# EAGLE board controller (EAGLE 6.6.0)
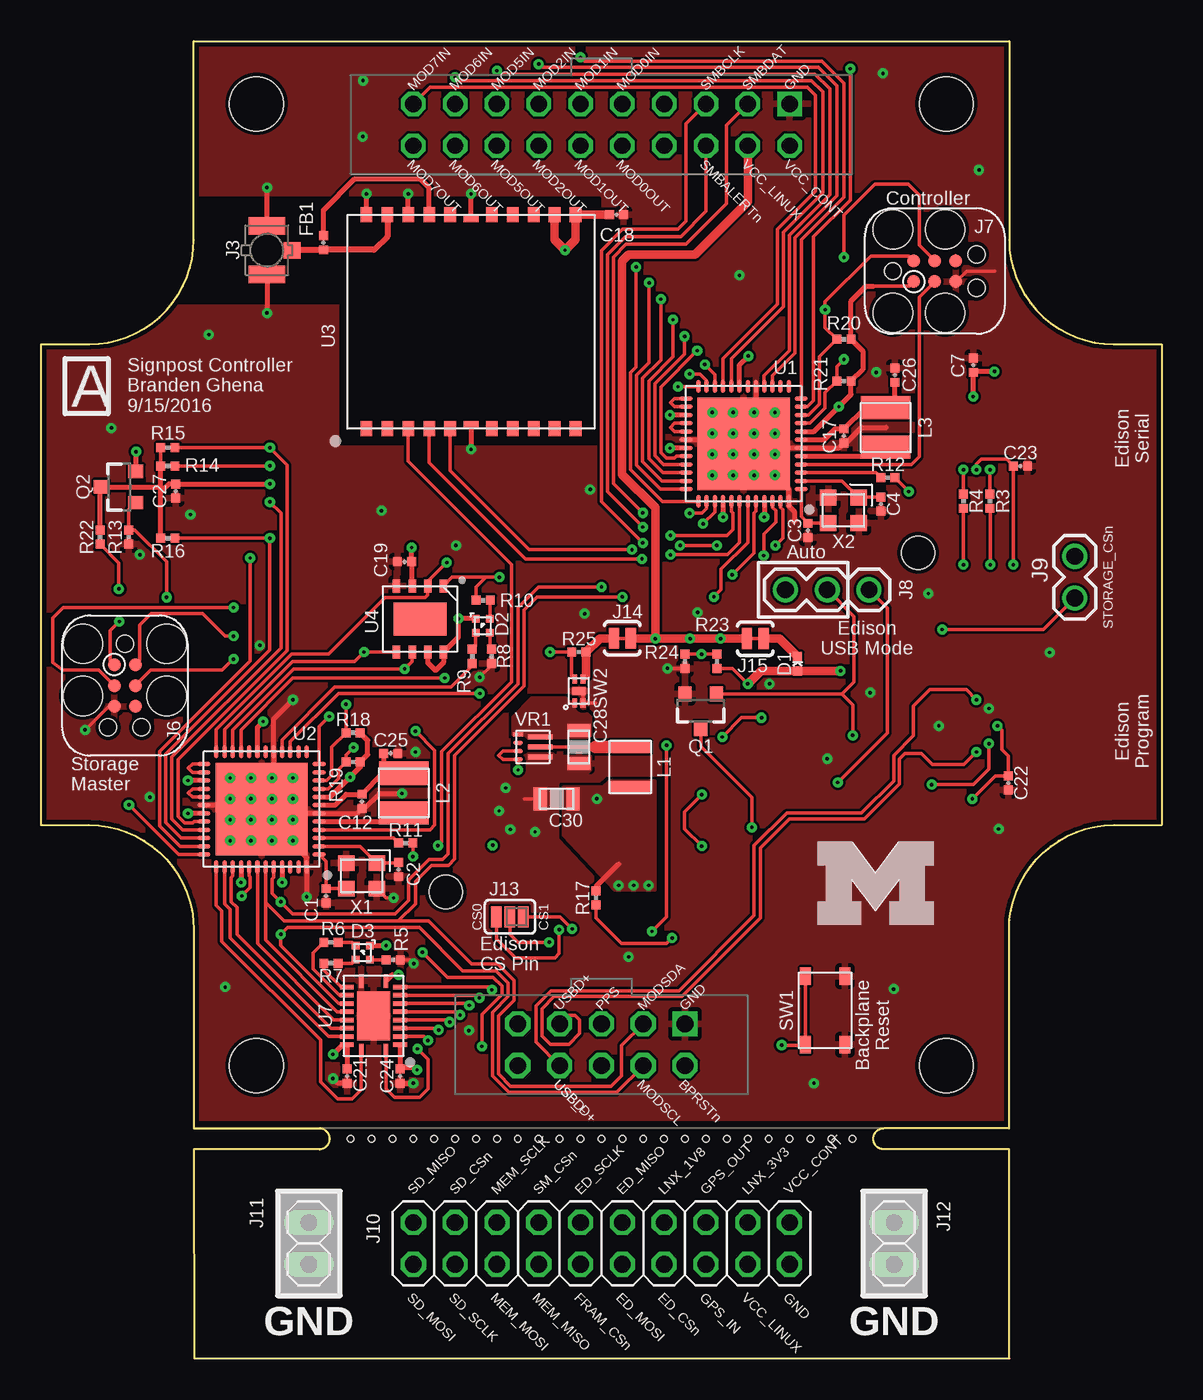
[diagram p5: board, top side]
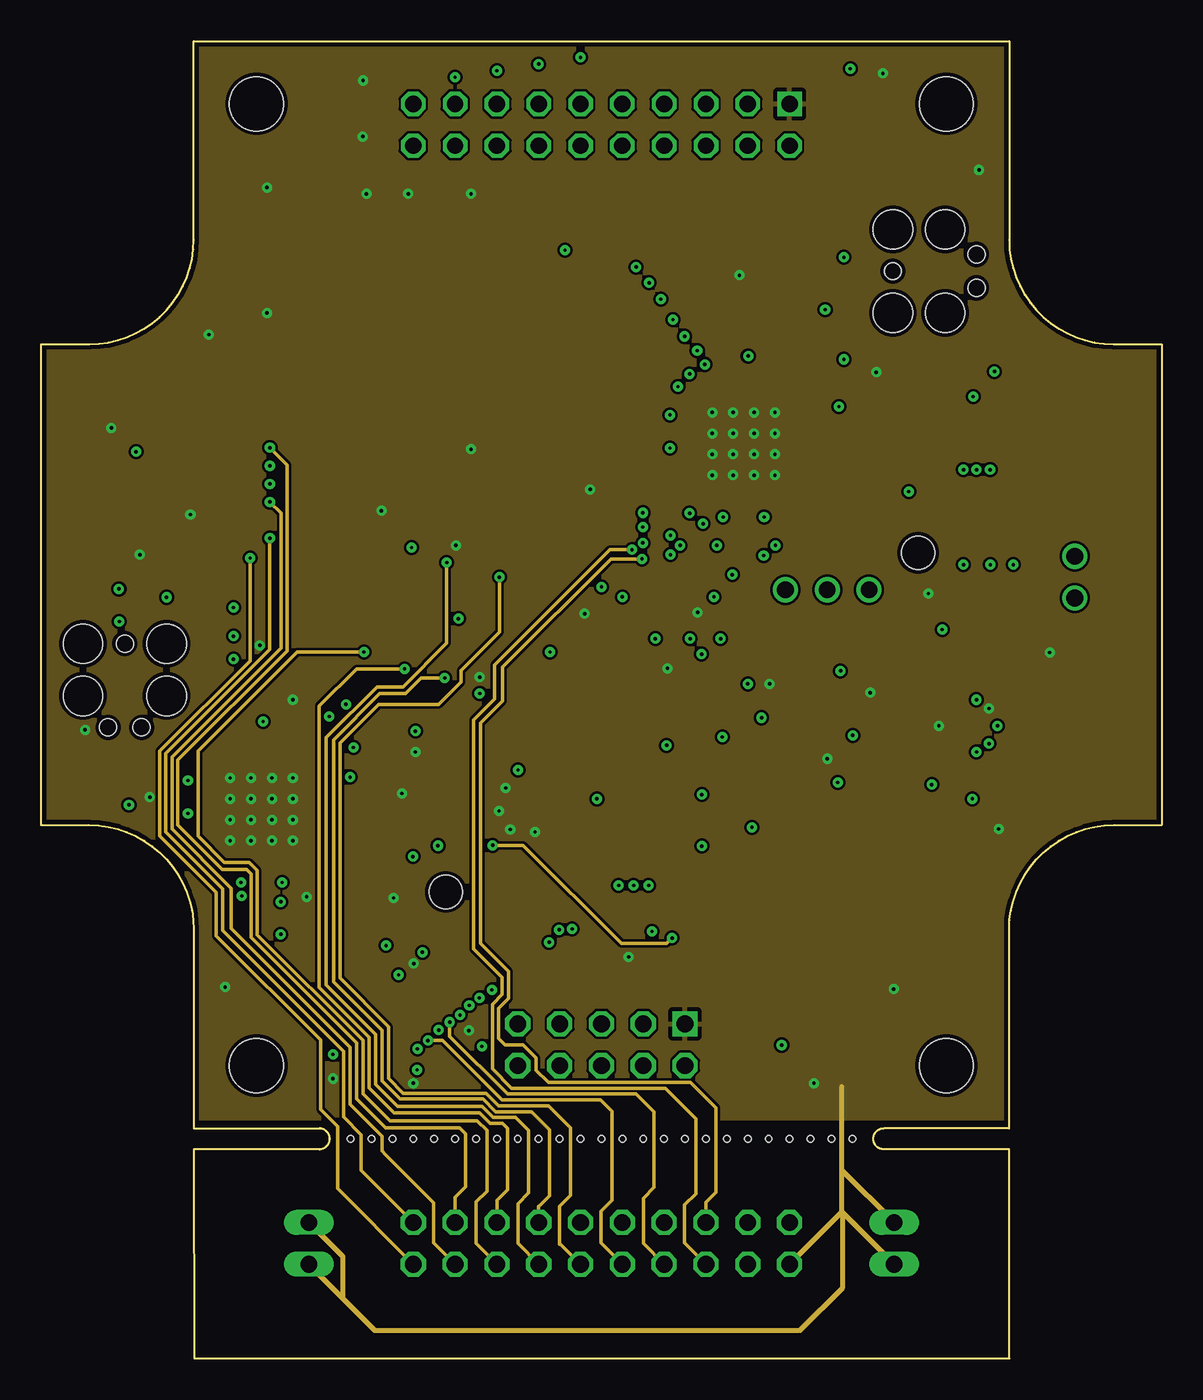
[diagram p6: board, inner layer Route2]
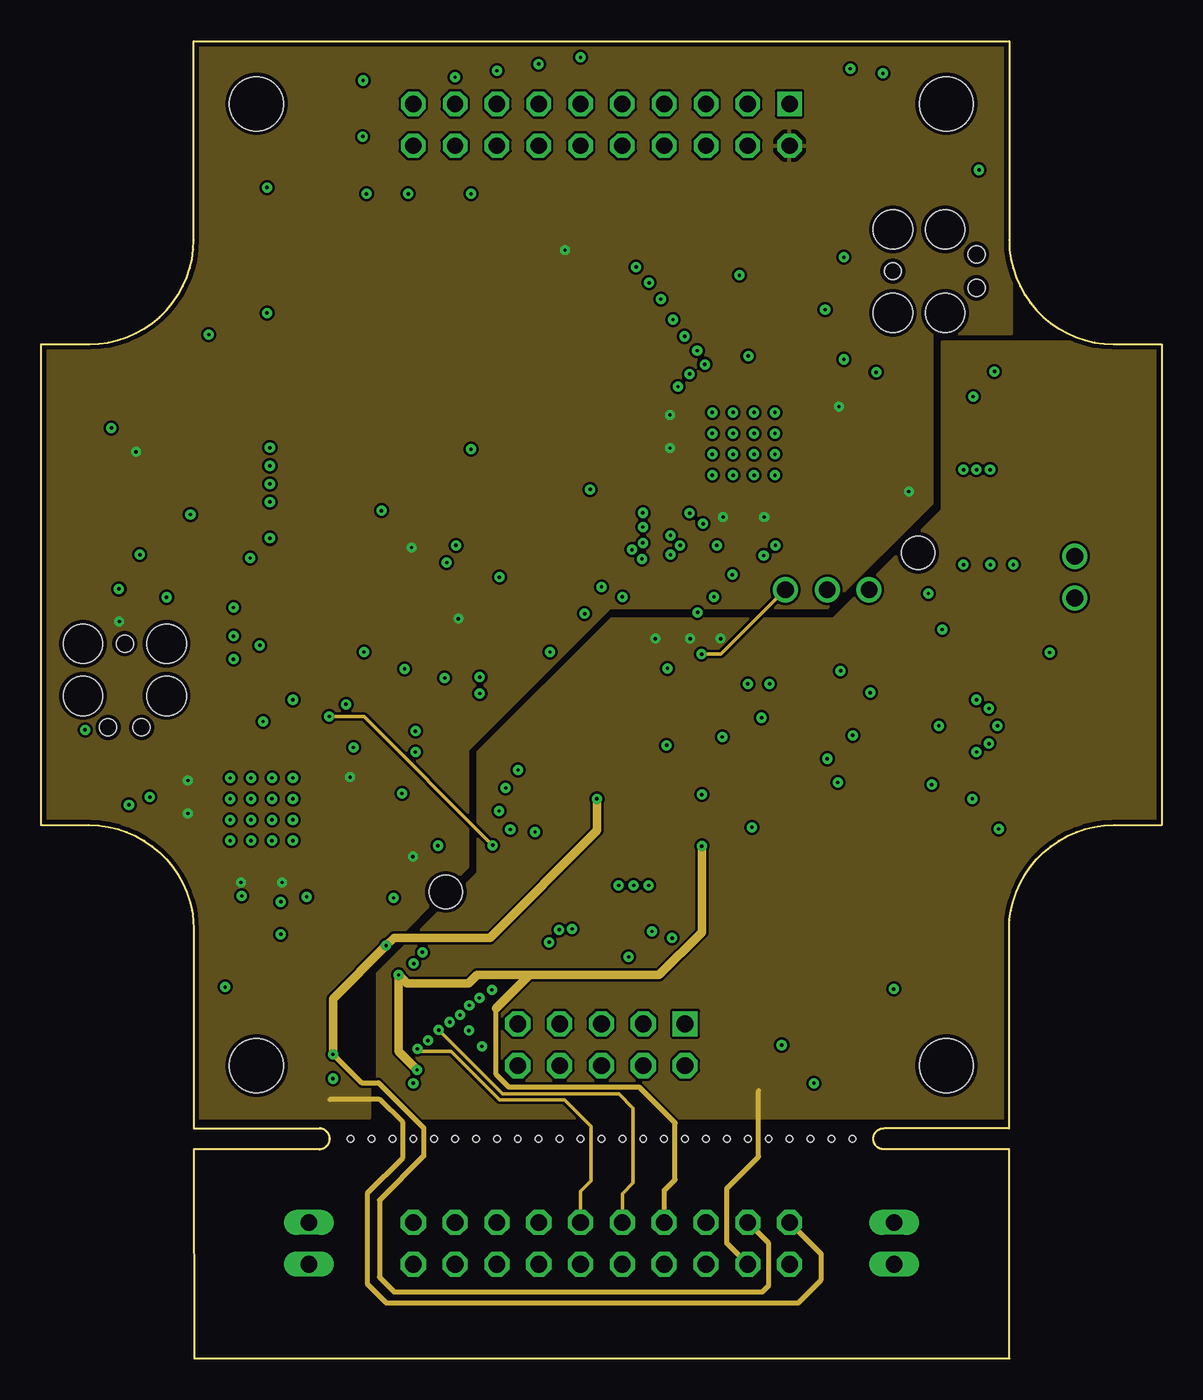
[diagram p7: board, inner layer Route15]
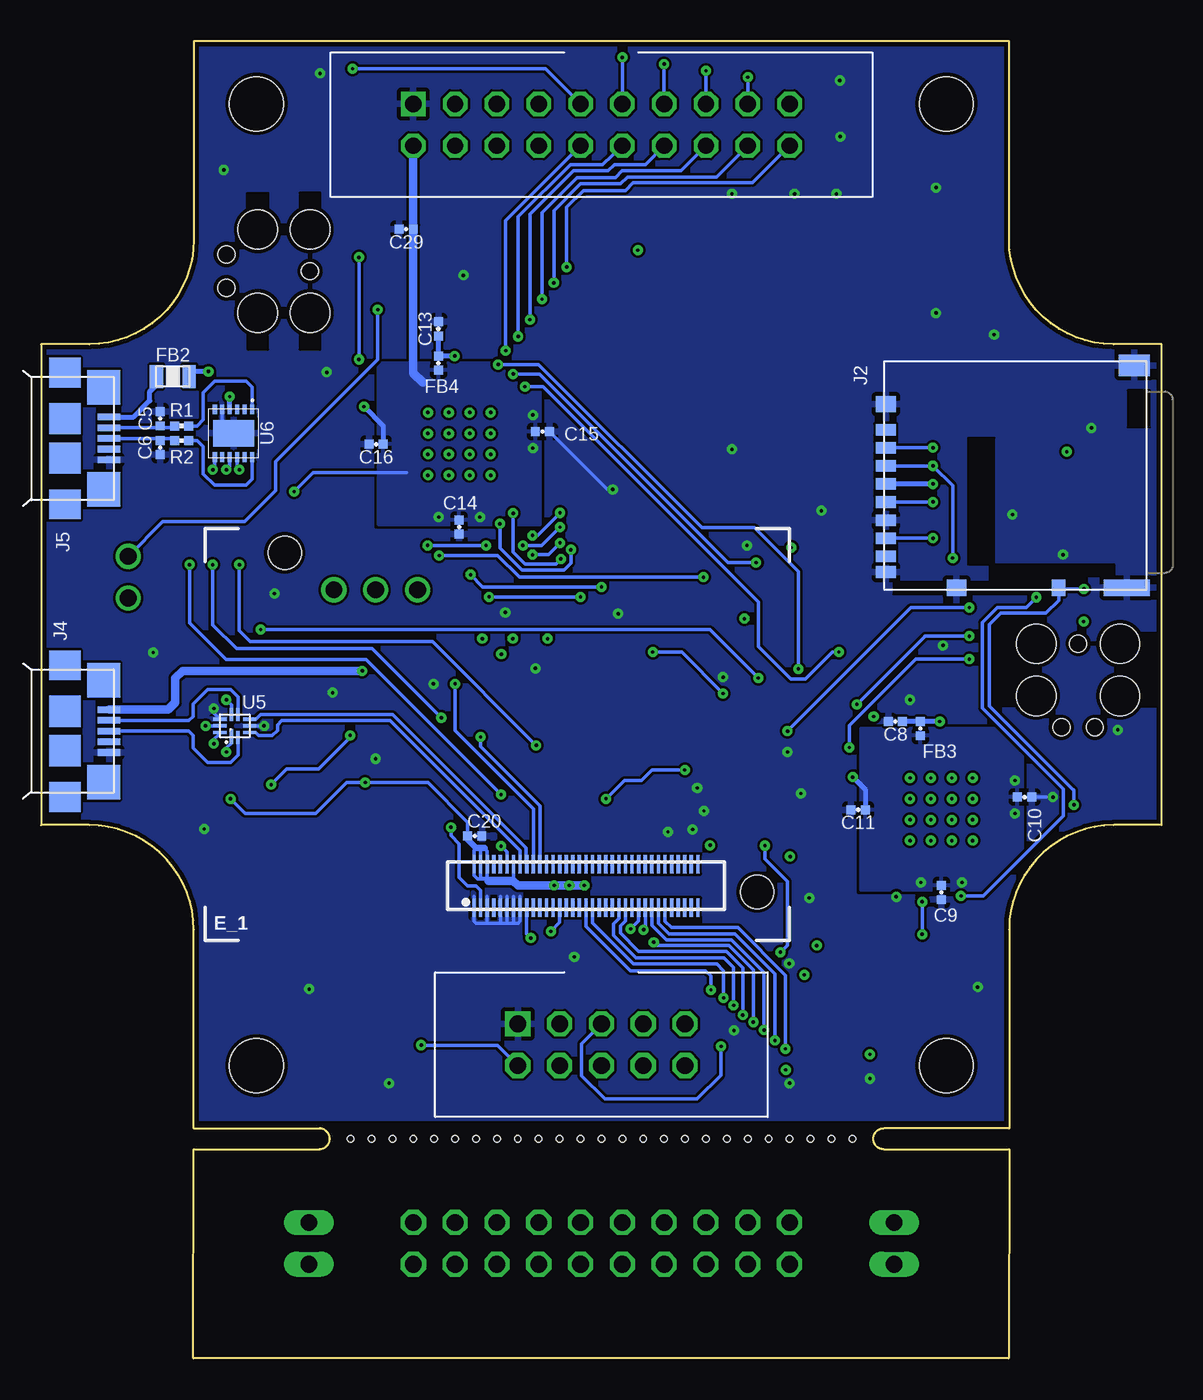
[diagram p8: board, bottom side, seen from below]

Size 68.07 x 80.01 mm. Coordinates in mm from the lower left corner, seen from the top.
Outline: 9.27,80.01 58.8,80.01 58.8,67.94 arc90 65.15,61.59 68.07,61.59 68.07,32.39 65.15,32.39 arc90 58.8,26.04 58.8,13.97 51.18,13.97 arc180 51.18,12.7 58.8,12.7 58.83,0 9.3,0 9.27,12.7 16.89,12.7 arc180 16.89,13.97 9.27,13.97 9.27,26.04 arc90 2.92,32.39 0,32.39 0,61.59 2.92,61.59 arc90 9.27,67.94 9.27,80.01
Copper layers (1+2*15+16): Top 0.0178mm / dielectric 12mil / Route2 0.0356mm / dielectric 28mil / Route15 0.0356mm / dielectric 12mil / Bottom 0.0178mm
Design rules "sunstone-4lyr_v1.0.0.3 *": minimum track width 6mil, minimum drill 8mil, track to track 6mil, track to pad 6mil, pad to pad 6mil, via to via 6mil, smd to smd 6mil, copper to edge 10mil, drill to drill 16mil, minimum pad ring 8mil, minimum via ring 8mil, stop-mask expansion 3mil, vias tented up to drill 50mil, thermal gap 10mil
Holes 0.38 mm at 34.04,13.34 35.31,13.34 32.77,13.34 37.85,13.34 39.12,13.34 36.58,13.34 30.23,13.34 31.5,13.34 28.96,13.34 45.47,13.34 46.74,13.34 44.2,13.34 49.28,13.34 48.01,13.34 41.66,13.34 42.93,13.34 40.39,13.34 22.61,13.34 23.88,13.34 21.34,13.34 26.42,13.34 27.69,13.34 25.15,13.34 18.8,13.34 20.07,13.34
Holes 3.26 mm at 13.08,76.2 54.99,76.2 54.99,17.78 13.08,17.78

## Footprints (pad centres in the part's own frame; a part is rotated, then mirrored left to right if it is on the bottom)
0402_CAP = smd 0.536 x 0.546: 1 -0.433,0; 2 0.433,0
0805_CAP = smd 0.8 x 1.4: P$1 1,0; P$2 -1,0
0402_DIODE = smd 0.536 x 0.546: ANODE -0.433,0; CATHODE 0.433,0
1MM_SQ_4PAD = smd 0.457 x 0.457: 1 0.432,0.432; 2 0.432,-0.432; 3 -0.432,-0.432; 4 -0.432,0.432
EDISON_DAUGHTER = smd 1.14 x 0.2: 1 1.98,19.17; 2 4.62,19.17; 3 1.98,18.77; 4 4.62,18.77; 5 1.98,18.37; 6 4.62,18.37; 7 1.98,17.97; 8 4.62,17.97; 9 1.98,17.57; 10 4.62,17.57; 11 1.98,17.17; 12 4.62,17.17; 13 1.98,16.77; 14 4.62,16.77; 15 1.98,16.37; 16 4.62,16.37; 17 1.98,15.97; 18 4.62,15.97; 19 1.98,15.57; 20 4.62,15.57; 21 1.98,15.17; 22 4.62,15.17; 23 1.98,14.77; 24 4.62,14.77; 25 1.98,14.37; 26 4.62,14.37; 27 1.98,13.97; 28 4.62,13.97; 29 1.98,13.57; 30 4.62,13.57; 31 1.98,13.17; 32 4.62,13.17; 33 1.98,12.77; 34 4.62,12.77; 35 1.98,12.37; 36 4.62,12.37; 37 1.98,11.97; 38 4.62,11.97; 39 1.98,11.57; 40 4.62,11.57; 41 1.98,11.17; 42 4.62,11.17; 43 1.98,10.77; 44 4.62,10.77; 45 1.98,10.37; 46 4.62,10.37; 47 1.98,9.97; 48 4.62,9.97; 49 1.98,9.57; 50 4.62,9.57; 51 1.98,9.17; 52 4.62,9.17; 53 1.98,8.77; 54 4.62,8.77; 55 1.98,8.37; 56 4.62,8.37; 57 1.98,7.97; 58 4.62,7.97; 59 1.98,7.57; 60 4.62,7.57; 61 1.98,7.17; 62 4.62,7.17; 63 1.98,6.77; 64 4.62,6.77; 65 1.98,6.37; 66 4.62,6.37; 67 1.98,5.97; 68 4.62,5.97; 69 1.98,5.57; 70 4.62,5.57 | hole 2: 23.53,30.67; 2.93,1.98
MODULE_CONTROLLER = drill 0.991 square: 1 11.43,29.21 | drill 0.991 octagon: 2 11.43,26.67; 3 8.89,29.21; 4 8.89,26.67; 5 6.35,29.21; 6 6.35,26.67; 7 3.81,29.21; 8 3.81,26.67; 9 1.27,29.21; 10 1.27,26.67; 11 -1.27,29.21; 12 -1.27,26.67; 13 -3.81,29.21; 14 -3.81,26.67; 15 -6.35,29.21; 16 -6.35,26.67; 17 -8.89,29.21; 18 -8.89,26.67; 19 -11.43,29.21; 20 -11.43,26.67 | drill 1.016 square: 21 5.08,-26.67 | drill 1.016 octagon: 22 5.08,-29.21; 23 2.54,-26.67; 24 2.54,-29.21; 25 0,-26.67; 26 0,-29.21; 27 -2.54,-26.67; 28 -2.54,-29.21; 29 -5.08,-26.67; 30 -5.08,-29.21
DM3AT-SF-PEJM5 = smd 0.7 x 1.2: 1 3.2,-0.1; 2 2.1,-0.1; 3 1,-0.1; 4 -0.1,-0.1; 5 -1.2,-0.1; 6 -2.3,-0.1; 7 -3.4,-0.1; 8 -4.5,-0.1; B -5.45,-0.1 | smd 1 x 0.8: A -6.4,-10.6 | smd 1 x 1.2: MOUNT0 4.75,-0.1; MOUNT1 -6.4,-4.4 | smd 1 x 2.8: MOUNT2 -6.4,-14.75 | smd 1.3 x 1.9: MOUNT3 7.1,-15.2
U.FL_SMT = smd 1.05 x 2.2: GND1 -1.475,0; GND2 1.475,0 | smd 1 x 1.05: SIG 0,-1.525
USB_MICRO_B-HIROSE-ZX62-B-5PA(11) = smd 0.4 x 1.35: 1 -1.3,4.125; 2 -0.65,4.125; 3 0,4.125; 4 0.65,4.125; 5 1.3,4.125 | smd 2.1 x 2: P$1 3.1,3.8; P$2 -3.1,3.8 | smd 1.8 x 1.9: P$3 -4,1.45; P$6 4,1.45 | smd 1.9 x 1.9: P$4 -1.2,1.45; P$5 1.2,1.45
TC2030-IDC = smd 0.787 x 0.787: 1 -1.27,-0.635; 2 -1.27,0.635; 3 0,-0.635; 4 0,0.635; 5 1.27,-0.635; 6 1.27,0.635 | hole 2.375: -2.54,2.54; 0.635,2.54; 0.635,-2.54; -2.54,-2.54 | hole 1.016: -2.54,0; 2.54,1.016; 2.54,-1.016
1X03 = drill 1.016: 1 -2.54,0; 2 0,0; 3 2.54,0
1X02 = drill 1.016: 1 0,0; 2 2.54,0
2X10 = drill 1.016 octagon: 1 -11.43,-1.27; 2 -11.43,1.27; 3 -8.89,-1.27; 4 -8.89,1.27; 5 -6.35,-1.27; 6 -6.35,1.27; 7 -3.81,-1.27; 8 -3.81,1.27; 9 -1.27,-1.27; 10 -1.27,1.27; 11 1.27,-1.27; 12 1.27,1.27; 13 3.81,-1.27; 14 3.81,1.27; 15 6.35,-1.27; 16 6.35,1.27; 17 8.89,-1.27; 18 8.89,1.27; 19 11.43,-1.27; 20 11.43,1.27
1X02' = drill 1.016 long: 1 -1.27,0; 2 1.27,0
SJ_3_PASTE2&3 = smd 0.635 x 1.27: 1 -0.813,0; 2 0,0; 3 0.813,0
SJ_2S-TRACE = smd 0.635 x 1.27: 1 -0.508,0; 2 0.508,0
DFE322512C = smd 0.75 x 2.5: P$1 1.225,0; P$2 -1.225,0
1212 = smd 1.4 x 3: P$1 -1.2,0; P$2 1.2,0
SOT23-3 = smd 0.8 x 0.9: 1 -0.95,-1; 2 0.95,-1; 3 0,1.1
0402_RES = smd 0.536 x 0.546: 1 -0.433,0; 2 0.433,0
PTS810SJ = smd 1.05 x 0.65: 1 -2.075,1.2; 2 2.075,1.2; 3 2.075,-1.2; 4 -2.075,-1.2
TDFN4 = smd 0.3 x 0.55: 1 -0.25,-0.725; 2 0.25,-0.725; 3 0.25,0.725; 4 -0.25,0.725 | smd 0.86 x 0.5: PAD 0,0
QFN-48-7MM = smd 0.8 x 0.28: 1 -3.5,2.75; 2 -3.5,2.25; 3 -3.5,1.75; 4 -3.5,1.25; 5 -3.5,0.75; 6 -3.5,0.25; 7 -3.5,-0.25; 8 -3.5,-0.75; 9 -3.5,-1.25; 10 -3.5,-1.75; 11 -3.5,-2.25; 12 -3.5,-2.75; 25 3.5,-2.75; 26 3.5,-2.25; 27 3.5,-1.75; 28 3.5,-1.25; 29 3.5,-0.75; 30 3.5,-0.25; 31 3.5,0.25; 32 3.5,0.75; 33 3.5,1.25; 34 3.5,1.75; 35 3.5,2.25; 36 3.5,2.75 | smd 0.28 x 0.8: 13 -2.75,-3.5; 14 -2.25,-3.5; 15 -1.75,-3.5; 16 -1.25,-3.5; 17 -0.75,-3.5; 18 -0.25,-3.5; 19 0.25,-3.5; 20 0.75,-3.5; 21 1.25,-3.5; 22 1.75,-3.5; 23 2.25,-3.5; 24 2.75,-3.5; 37 2.75,3.5; 38 2.25,3.5; 39 1.75,3.5; 40 1.25,3.5; 41 0.75,3.5; 42 0.25,3.5; 43 -0.25,3.5; 44 -0.75,3.5; 45 -1.25,3.5; 46 -1.75,3.5; 47 -2.25,3.5; 48 -2.75,3.5 | smd 5.6 x 5.6: THERMAL 0,0
RXM-GPS-RM-T = smd 0.711 x 0.914: 1 -6.35,-6.502; 2 -5.08,-6.502; 3 -3.81,-6.502; 4 -2.54,-6.502; 5 -1.27,-6.502; 6 1.27,-6.502; 7 2.54,-6.502; 8 3.81,-6.502; 9 5.08,-6.502; 10 6.35,-6.502; 11 6.35,6.502; 12 5.08,6.502; 13 3.81,6.502; 14 2.54,6.502; 15 1.27,6.502; 16 -1.27,6.502; 17 -2.54,6.502; 18 -3.81,6.502; 19 -5.08,6.502; 20 -6.35,6.502 | smd 0.914 x 0.457: 21 0,-6.274; 22 0,6.274
TDFN-8 = smd 0.45 x 0.8: 1 -1.425,-2.007; 2 -0.475,-2.007; 3 0.475,-2.007; 4 1.425,-2.007; 5 1.425,2.007; 6 0.475,2.007; 7 -0.475,2.007; 8 -1.425,2.007 | smd 3.2 x 2: NC 0,0
UQFN-10 = smd 0.2 x 0.9: 1 -0.2,-0.65 | smd 0.2 x 0.8: 2 0.2,-0.7; 6 0.2,0.7; 7 -0.2,0.7 | smd 0.8 x 0.2: 3 0.9,-0.4; 4 0.9,0; 5 0.9,0.4; 8 -0.9,0.4; 9 -0.9,0; 10 -0.9,-0.4
DFN-12/3MM = smd 0.6 x 0.25: 1 -1.45,1.13; 2 -1.45,0.68; 3 -1.45,0.23; 4 -1.45,-0.23; 5 -1.45,-0.68; 6 -1.45,-1.13; 7 1.45,-1.13; 8 1.45,-0.68; 9 1.45,-0.23; 10 1.45,0.23; 11 1.45,0.68; 12 1.45,1.13 | smd 1.6 x 2.5: 13 0,0
R-PVQFN-N20 = smd 0.825 x 0.28: 1 -2.112,-0.75; 10 2.112,-0.75; 11 2.112,0.75; 20 -2.112,0.75 | smd 0.28 x 0.825: 2 -1.75,-1.613; 3 -1.25,-1.613; 4 -0.75,-1.613; 5 -0.25,-1.613; 6 0.25,-1.613; 7 0.75,-1.613; 8 1.25,-1.613; 9 1.75,-1.613; 12 1.75,1.613; 13 1.25,1.613; 14 0.75,1.613; 15 0.25,1.613; 16 -0.25,1.613; 17 -0.75,1.613; 18 -1.25,1.613; 19 -1.75,1.613 | smd 3 x 2: THERMAL 0,0
RLT0007A = smd 0.6 x 0.25: 1 -0.9,0.75; 2 -0.9,0.25; 3 -0.9,-0.25; 4 -0.9,-0.75 | smd 1.5 x 0.3: 5 0.45,-0.6; 6 0.45,0; 7 0.45,0.6
FHXXX = smd 1 x 0.95: 1 -0.925,-0.775; 2 0.925,-0.775; 3 0.925,0.775; 4 -0.925,0.775

## Placement (x,y rotation side)
C1  8pF  [0402_CAP]  17.3,28.09 270 top
C2  8pF  [0402_CAP]  21.72,29.69 270 top
C3  8pF  [0402_CAP]  46.58,50.29 270 top
C4  8pF  [0402_CAP]  51,51.89 270 top
C5  47pF  [0402_CAP]  60.83,57.07 90 bottom
C6  47pF  [0402_CAP]  60.83,55.32 270 bottom
C7  10nF  [0402_CAP]  56.62,60.33 90 top
C8  100nF  [0402_CAP]  16.18,38.68 180 bottom
C9  100nF  [0402_CAP]  13.39,28.3 270 bottom
C10  100nF  [0402_CAP]  8.33,34.09 0 bottom
C11  100nF  [0402_CAP]  18.44,33.32 180 bottom
C12  100nF  [0402_CAP]  19.48,33.83 270 top
C13  100nF  [0402_CAP]  43.94,62.53 90 bottom
C14  100nF  [0402_CAP]  42.67,50.5 270 bottom
C15  100nF  [0402_CAP]  37.62,56.29 0 bottom
C16  100nF  [0402_CAP]  47.73,55.52 180 bottom
C17  100nF  [0402_CAP]  48.77,56.03 270 top
C18  100nF  [0402_CAP]  34.95,69.47 0 top
C19  100nF  [0402_CAP]  22.07,48.39 180 top
C20  100nF  [0402_CAP]  41.73,31.72 0 bottom
C21  100nF  [0402_CAP]  18.58,17.15 90 top
C22  100nF  [0402_CAP]  58.75,34.95 270 top
C23  100nF  [0402_CAP]  59.49,54.2 0 top
C24  100nF  [0402_CAP]  21.81,17.15 90 top
C25  4.7uF  [0402_CAP]  21.23,36.75 0 top
C26  4.7uF  [0402_CAP]  51.87,59.72 90 top
C27  4.7uF  [0402_CAP]  8.18,52.68 270 top
C28  10uF  [0805_CAP]  32.66,37.13 90 top
C29  10uF  [0402_CAP]  45.9,68.58 180 bottom
C30  22uF  [0805_CAP]  31.32,33.99 0 top
D1  DIODE  [0402_DIODE]  45.95,42.19 90 top
D2  SML-LX0404SIUPGUSB  [1MM_SQ_4PAD]  26.82,44.5 90 top
D3  SML-LX0404SIUPGUSB  [1MM_SQ_4PAD]  19.53,24.64 0 top
E_1  EDISON_CONNECTOR_SEGMENTED  [EDISON_DAUGHTER]  22.61,25.4 90 bottom
FB1  300Ω  [0402_CAP]  17.15,67.77 270 top
FB2  600Ω  [0805_CAP]  60.07,59.64 0 bottom
FB3  1.5kΩ  [0402_CAP]  14.66,38.25 270 bottom
FB4  1.5kΩ  [0402_CAP]  43.94,60.45 270 bottom
J1  MODULE_CONTROLLER  [MODULE_CONTROLLER]  34.04,46.99 0 top
J2  DM3AT-SF-PEJM5  [DM3AT-SF-PEJM5]  16.87,53.21 90 bottom
J3  U.FL-R-SMT  [U.FL_SMT]  13.72,67.31 90 top
J4  MICRO_USB_B_HIROSE_ZX62-B-5PA(11)  [USB_MICRO_B-HIROSE-ZX62-B-5PA(11)]  68.07,38.1 270 bottom
J5  MICRO_USB_B_HIROSE_ZX62-B-5PA(11)  [USB_MICRO_B-HIROSE-ZX62-B-5PA(11)]  68.07,55.88 270 bottom
J6  TC2030-JLINK-L  [TC2030-IDC]  5.08,40.87 270 top
J7  TC2030-JLINK-L  [TC2030-IDC]  54.28,66.04 0 top
J8  JUMPER-3PTH  [1X03]  47.75,46.69 0 top
J9  [1X02]  62.79,48.72 270 top
J10  [2X10]  34.04,6.98 0 top
J11  [1X02']  16.26,6.98 90 top
J12  [1X02']  51.82,6.98 90 top
J13  [SJ_3_PASTE2&3]  28.47,26.82 0 top
J14  SOLDERJUMPERTRACE  [SJ_2S-TRACE]  35.31,43.74 180 top
J15  SOLDERJUMPERTRACE  [SJ_2S-TRACE]  43.38,43.71 0 top
L1  0.47uH  [DFE322512C]  35.79,35.92 90 top
L2  22uH  [1212]  22.02,34.34 270 top
L3  22uH  [1212]  51.31,56.54 270 top
LOGO1  UMICH_SOLID_MEDIUM  [UMICH_SOLID_200MIL]  47.14,26.31 0 top
Q1  MOSFET-NCHANNELSMD  [SOT23-3]  40.07,39.34 180 top
Q2  NX3008PBK  [SOT23-3]  4.75,52.93 90 top
R1  27Ω  [0402_RES]  59.54,56.64 0 bottom
R2  27Ω  [0402_RES]  59.54,55.75 0 bottom
R3  100Ω  [0402_RES]  57.64,52.07 270 top
R4  100Ω  [0402_RES]  56.03,52.07 270 top
R5  1kΩ  [0402_RES]  21.39,24.21 0 top
R6  1kΩ  [0402_RES]  17.6,25.27 180 top
R7  1kΩ  [0402_RES]  17.6,24 180 top
R8  1kΩ  [0402_RES]  27.36,42.65 270 top
R9  1kΩ  [0402_RES]  26.19,42.65 270 top
R10  1kΩ  [0402_RES]  26.85,46.05 180 top
R11  10kΩ  [0402_RES]  22.15,31.29 0 top
R12  10kΩ  [0402_RES]  51.44,53.49 0 top
R13  10kΩ  [0402_RES]  5.31,49.89 90 top
R14  10kΩ  [0402_RES]  7.7,54.21 180 top
R15  10kΩ  [0402_RES]  7.7,55.31 180 top
R16  10kΩ  [0402_RES]  7.7,49.81 180 top
R17  10kΩ  [0402_RES]  33.71,27.97 90 top
R18  100kΩ  [0402_RES]  18.95,38 0 top
R19  100kΩ  [0402_RES]  18.95,36.22 0 top
R20  100kΩ  [0402_RES]  48.77,61.9 0 top
R21  100kΩ  [0402_RES]  48.77,59.36 0 top
R22  100kΩ  [0402_RES]  3.57,49.89 90 top
R23  332kΩ  [0402_RES]  41.05,42.34 270 top
R24  665kΩ  [0402_RES]  39.12,42.34 90 top
R25  1MΩ  [0402_RES]  32.66,42.9 0 top
SW1  PTS810SJ  [PTS810SJ]  47.62,21.13 90 top
SW2  SIP3240X  [TDFN4]  32.66,40.54 0 top
U1  SAM4LC8AA  [QFN-48-7MM]  42.67,55.55 180 top
U2  SAM4LC8AA  [QFN-48-7MM]  13.39,33.35 180 top
U3  RXM-GPS-RM-T  [RXM-GPS-RM-T]  26.11,62.97 0 top
U4  FM25CLXXB-DG  [TDFN-8]  23.01,44.91 180 top
U5  TS3USB30E  [UQFN-10]  56.31,38.42 0 bottom
U6  FTDI234XD  [DFN-12/3MM]  56.39,56.2 270 bottom
U7  TXS0108EVQFN20  [R-PVQFN-N20]  20.19,20.8 90 top
VR1  TPS62086  [RLT0007A]  29.87,37.13 0 top
X1  16MHz  [FHXXX]  19.46,29.31 180 top
X2  16MHz  [FHXXX]  48.74,51.51 180 top

## Tracks (layer width: path | path; a pad name or v marks a point on that pad's centre or on a via)
!BACKPLANE_RESET  (via drill 0.2)
  Top 0.203: v44.98,19.03 46.42,19.03 SW1.1 SW1.2
  Bottom 0.203: J1.22 40.36,19.03 v44.98,19.03
!CONTROLLER_RESET
  Top 0.203: U1.4 52.87,54.3 53.34,54.77 53.34,64.47 J7.3
!EDISON_PWRBTN  (via drill 0.2)
  Top 0.203: v38.33,25.53 38,25.2 35.26,25.2 33.71,26.75 R17.1 | 17.53,38.99 17.5,38.96 v17.5,38.99 16.89,38.37 U2.12
  Route2 0.203: v38.33,25.53 38,25.2 35.26,25.2 29.29,31.17 v27.43,31.17
  Route15 0.203: v27.43,31.17 19.61,38.99 v17.5,38.99
  Bottom 0.203: E_1.17 38.58,25.77 v38.33,25.53
!EDISON_SPI_CS
  Top 0.203: U2.42 13.14,25.19 17.78,20.55 U7.16
!EDISON_SPI_CS_1V8  (via drill 0.2)
  Top 0.203: U7.5 24.69,20.55 v24.82,20.42 | v30.86,25.27 28.96,25.27 28.47,25.76 J13.2
  Route2 0.203: v24.82,20.42 24.82,19.56 28.32,16.05 36.14,16.05 37.24,14.96 37.24,10.39 36.58,9.73 36.58,6.98 J10.13
  Bottom 0.203: v24.82,20.42 24.82,23.6 26.29,25.07 30.66,25.07 v30.86,25.27
!FRAM_CS/CONTROLLER_LED  (via drill 0.2)
  Top 0.203: v43.89,48.77 43.89,50.06 44.63,50.8 44.63,51.49 44.42,51.69 U1.46 | U4.1 24.97,47.45 v27.84,47.45 27.03,47.45 26.42,46.84 R10.2
  Route2 0.203: v27.84,47.45 27.84,44.12 25.5,41.78 25.5,41.07 24.16,39.73 20.5,39.73 18.16,37.38 18.16,23.09 21.11,20.14 21.11,16.99 22,16.1 27.03,16.1 27.79,15.34 30.81,15.34 32.16,14 32.16,9.91 31.5,9.25 31.5,6.93 31.55,6.93 J10.9
  Bottom 0.203: v43.89,48.77 40.34,48.77 39.01,47.45 v27.84,47.45
!SD_CS  (via drill 0.2)
  Top 0.203: v13.89,55.31 R15.1 | U2.32 9.31,32.6 9.22,32.51 8.71,32.51 8.31,32.9 8.31,36.37 14.94,43 14.94,54.27 v13.89,55.31 | 13.98,55.31 v13.89,55.31
  Route2 0.203: v13.89,55.31 14.94,54.27 14.94,42.98 8.31,36.35 8.31,32.39 11,29.69 12.47,29.69 12.75,29.41 12.75,25.58 19.18,19.15 19.18,15.75 20.93,14 25.43,14 25.78,13.64 25.78,10.41 25.15,9.78 J10.4
  Bottom 0.203: J2.2 v13.89,55.31
!SMBALERT  (via drill 0.2)
  Top 0.203: U1.47 44.92,51.69 45.06,51.55 45.06,49.84 v44.6,49.38 | J1.6 40.39,69.67 38.86,68.15 35.49,68.15 34.4,67.06 34.4,52.65 v36.55,50.5 | v38.81,49.38 v41.05,49.38
  Bottom 0.203: v36.55,50.5 37.67,49.38 v38.81,49.38 | v44.6,49.38 v41.05,49.38
!STORAGE_CS  (via drill 0.2)
  Top 0.203: U2.21 12.14,38.17 15.29,41.33 v24.51,41.33 | J9.2 60.88,44.27 v54.74,44.27
  Route2 0.203: v24.51,41.33 23.09,41.33 22.15,40.39 20.57,40.39 17.75,37.56 17.75,22.86 20.7,19.91 20.7,16.84 21.79,15.75 26.85,15.75 27.61,14.99 29.79,14.99 30.89,13.89 30.89,9.88 30.25,9.25 30.23,9.25 J10.8
  Bottom 0.203: v24.51,41.33 27.46,44.27 v54.74,44.27
!STORAGE_LED
  Top 0.203: U2.16 14.64,37.57 17.83,40.77 24.89,40.77 26.19,42.06 R9.2
!STORAGE_RESET  (via drill 0.2)
  Top 0.203: J6.3 3.51,41.81 1.32,41.81 0.71,42.27 0.71,44.98 1.34,45.6 v11.68,45.6 | U2.4 23.62,32.1 23.9,32.39 23.9,36.93 v22.73,38.1
  Bottom 0.203: v11.68,45.6 15.23,45.6 v22.73,38.1
CONTROLLER_BUCK/LDO_N
  Top 0.203: U1.3 50.7,53.8 R12.1
CONTROLLER_SWDCLK  (via drill 0.2)
  Top 0.203: U1.9 46.69,56.8 47.62,57.73 47.62,58.65 R21.1 48.34,60.25 v48.77,60.68 | J7.4 53.34,67.62 53.34,70.66 52.68,71.32 50.65,71.32 48.77,69.44 v48.77,66.88
  Bottom 0.203: v48.77,60.68 v48.77,66.88
CONTROLLER_SWDIO  (via drill 0.2)
  Top 0.203: U1.10 46.61,57.3 47.27,57.96 47.27,60.83 R20.1 47.62,62.61 v47.62,63.7 47.62,64.19 50.39,66.95 52.7,66.95 J7.2
  Bottom 0.203: v47.62,63.7 47.62,60.68 53.82,54.48 53.82,52.7 55.7,50.83 60.68,50.83 J9.1
CONTROLLER_XIN
  Top 0.203: U1.1 46.17,51.14 C3.1 47.81,50.73 X2.3
CONTROLLER_XOUT
  Top 0.203: C4.1 49.71,52.33 X2.1 48.65,53.3 U1.2
D+
  Bottom 0.203: J5.3 60.86,55.88 | 60.86,55.88 60.02,55.88 | 60.02,55.88 59.84,55.88 | C6.1 60.83,55.86 60.86,55.88 | R2.1 59.97,55.83 60.02,55.88
D-
  Bottom 0.203: J5.2 60.78,56.53 | 60.78,56.53 59.86,56.53 | C5.1 60.83,56.58 60.78,56.53 | 59.85,56.53 59.86,56.53 | 59.86,56.53 R1.1
EDISON_SPI_MISO
  Top 0.203: U2.39 11.64,29.29 11.56,29.21 11.56,27.74 11.91,27.38 11.91,25.76 17.62,20.05 U7.17
EDISON_SPI_MISO_1V8  (via drill 0.2)
  Top 0.203: U7.4 24.04,20.05 v24.16,19.94
  Route15 0.203: v24.16,19.94 28.04,16.05 35.1,16.05 35.97,15.19 35.97,10.67 35.31,10.01 J10.12
  Bottom 0.203: v24.16,19.94 24.16,23.44 26.14,25.43 30.1,25.43 30.98,26.3 E_1.55
EDISON_SPI_MOSI
  Top 0.203: U2.38 11.14,27.6 11.48,27.25 11.48,25.53 17.46,19.55 U7.18
EDISON_SPI_MOSI_1V8  (via drill 0.2)
  Top 0.203: U7.3 23.25,19.55 v23.5,19.3
  Route2 0.203: J10.11 34.01,7.01 34.01,8.94 34.67,9.6 34.67,15.01 33.98,15.7 27.99,15.7 24.38,19.3 v23.5,19.3
  Bottom 0.203: E_1.57 30.58,26.41 29.95,25.78 25.93,25.78 23.5,23.34 v23.5,19.3
EDISON_SPI_SCLK
  Top 0.203: U2.37 10.64,27.52 10.97,27.18 10.97,25.32 16.97,19.33 16.97,16.79 18.01,15.75 18.9,15.75 19.44,16.29 U7.20
EDISON_SPI_SCLK_1V8  (via drill 0.2)
  Top 0.203: U7.1 20.94,16.37 21.46,15.85 22.99,15.85 23.51,16.37 23.51,18.15 v22.86,18.8
  Route15 0.203: v22.86,18.8 23.01,18.64 24.89,18.64 27.84,15.7 31.8,15.7 33.4,14.1 33.4,10.8 32.77,10.16 J10.10
  Bottom 0.203: E_1.59 30.18,26.54 29.79,26.16 25.76,26.16 22.86,23.27 v22.86,18.8
EDISON_UART_RX  (via drill 0.2)
  Top 0.203: v41.38,37.74 42.55,38.91 v43.76,38.91 | v57.66,48.21 57.66,51.62 R3.2
  Bottom 0.203: E_1.22 37.78,33.56 41.38,37.16 v41.38,37.74 | v43.76,38.91 47.95,43.1 56.21,43.1 57.66,44.55 v57.66,48.21
EDISON_UART_TX  (via drill 0.2)
  Top 0.203: v37.11,25.93 38,26.82 v38,37.24 | v56.03,48.21 R4.2
  Bottom 0.203: E_1.27 36.58,26.47 v37.11,25.93 | v38,37.24 44.3,43.54 55.37,43.54 56.03,44.2 v56.03,48.21
GND  (via drill 0.2)
  Top 0.203: SW2.PAD 32.91,40.29 SW2.2 33.68,39.81 | C30.P$2 29.36,33.98 | J7.5 56.24,66.04 57.94,66.04 | R8.2 27.36,42.09 v26.65,41.38 | X1.4 20.95,27.97 v21.41,27.97 | R5.2 22.4,24.21 v22.63,23.98 | U1.THERMAL 42.67,55.52 | R24.1 v38.05,41.91 | J6.5 4.09,39.6 v2.67,38.18
  Top 0.305: U1.THERMAL 42.92,55.3 U1.6 48.47,55.3 C17.2 48.89,55.6 49.84,56.54 51.33,56.54 | U1.17 43.42,56.3 U1.THERMAL | U1.30 42.42,55.8 U1.THERMAL | 42.67,55.52 45.42,52.77 U1.48 45.42,51.77 45.75,51.44 45.75,50.8 | U2.THERMAL 13.64,33.1 U2.6 19.18,33.1 C12.2 19.63,33.4 20.55,34.31 v21.92,34.31 | U2.THERMAL 13.39,33.17 16.14,30.42 U2.48 v16.14,28.05 v16.13,28.04 | U2.30 13.14,33.6 U2.THERMAL | U2.THERMAL 14.14,34.1 U2.17 14.14,38.85 v15.29,40.01 | C27.2 8.18,52.15 | C21.1 18.01,16.71 v17.73,16.99 | C24.1 v22.61,16.71 | U3.21 v26.11,55.22 | U3.22 v26.11,70.74 | U3.20 v19.76,70.74 | U3.18 v22.3,70.74 | J3.GND2 v13.72,71.12 | J3.GND1 v13.72,63.5
  Route2 0.305: 48.64,11.43 48.64,9.5 48.64,8.89 | 48.64,11.43 48.64,16.51 | 48.67,8.87 J12.1 | J12.2 48.64,11.43 | 48.64,8.89 48.67,8.87 | 48.67,8.87 48.67,4.27 46.1,1.7 20.27,1.7 18.31,3.66 | J11.1 18.31,3.66 | J11.2 18.31,6.2 18.31,3.66 | J10.19 48.64,8.89
  Bottom 0.203: U6.5 57.07,56.88 U6.13 | U5.8 57.58,39.19 v57.58,39.47 | U5.4 v54.53,38.42 | 39.37,26.42 39.12,26.42 38.98,26.56 E_1.15 38.98,28.07 | 39.37,26.42 39.88,26.42 | 39.88,26.42 40.13,26.42 | 40.13,26.42 40.89,26.42 | 40.89,26.42 41.64,26.42 41.78,26.55 E_1.1 41.78,28.07 | 39.37,26.42 39.38,26.42 E_1.13 39.38,28.07 | 39.88,26.42 39.78,26.52 E_1.11 39.78,28.07 | 40.13,26.42 40.18,26.46 E_1.9 40.18,28.07 | 40.89,26.42 40.98,26.5 E_1.5 40.98,28.07 | C10.2 v6.6,34.09 | C15.2 33.68,52.78 v33.35,52.78
  other vias: 47.75,36.42 50.72,59.89 56.97,72.19 22.73,36.83 9.07,51.26 5.99,48.82 12.75,32.72 14.02,32.72 12.75,33.99 14.02,33.99 15.29,33.99 15.29,35.26 14.02,35.26 12.75,35.26 11.48,35.26 11.48,33.99 11.48,32.72 11.48,31.45 12.75,31.45 15.29,31.45 15.29,32.72 14.02,31.45 43.31,56.18 43.31,54.91 44.58,56.18 44.58,54.91 44.58,53.64 43.31,53.64 44.58,57.45 43.31,57.45 42.04,57.45 40.77,57.45 40.77,56.18 42.04,56.18 42.04,54.91 40.77,54.91 40.77,53.64 42.04,53.64 19.53,74.22 19.56,77.62 51.13,78.05 42.42,65.79 10.19,62.18 4.27,56.52 20.68,51.49 33.02,45.24 39.88,45.31 53.9,46.46 61.26,42.88 58.17,32.16 51.79,22.43 46.94,16.71 35.69,24.38 27.81,33.25 11.18,22.56 25.98,19.91 50.37,40.44 25.2,49.38 44.25,40.97 13.28,43.31 28.22,34.65 30,31.98 28.5,32.13
  pour Top (rank 2): -2.79,14.61 70.87,14.61 70.87,82.55 -2.79,82.55
  pour Bottom (rank 2): -2.79,14.61 70.87,14.61 70.87,82.55 -2.79,82.55
  pour Top (no thermals): 31.09,36.55 33.38,36.55 33.38,35.73 32.85,35.2 31.47,35.2 30.96,34.7 30.96,32.79 29.57,32.79 29.57,36.7 31.09,36.7
  pour Route2: -2.79,14.61 70.87,14.61 70.87,82.55 -2.79,82.55
  cutout Top: 8.64,70.48 8.64,64.14 18.21,64.14 18.21,55.58 33.91,55.58 33.91,70.48
GPS_IN_RX  (via drill 0.2)
  Top 0.203: U1.39 40.92,51.41 v40.21,50.7 | U3.5 24.84,53.92 29.64,49.12 v35.89,49.12
  Route2 0.203: v35.89,49.12 34.54,49.12 27.53,42.12 27.53,40.06 26.26,38.79 26.26,24.87 27.99,23.14 27.99,22.1 27.41,21.51 27.41,17.58 28.58,16.41 37.92,16.41 39.78,14.55 39.78,10.01 39.09,9.32 39.09,7.01 J10.15
  Bottom 0.203: v40.21,50.7 40.21,49.23 38.87,47.89 36.32,47.89 35.89,48.31 v35.89,49.12
GPS_OUT_TX  (via drill 0.2)
  Top 0.203: U1.38 40.42,51.62 40.13,51.33 v39.4,51.33 | v36.5,48.57 29.41,48.57 23.57,54.41 U3.4
  Route2 0.203: v36.5,48.57 34.62,48.57 28.04,41.99 28.04,39.93 26.7,38.58 26.7,25.2 28.4,23.5 28.4,21.87 27.79,21.26 27.79,19.43 28.17,19.05 29.29,19.05 30.07,18.26 30.07,17.5 30.81,16.76 39.45,16.76 41,15.22 41,10.08 40.39,9.47 J10.16
  Bottom 0.203: v39.4,51.33 39.4,48.97 38.68,48.26 36.8,48.26 v36.5,48.57
LINUX_5V_IN
  pour Top (isolate 0.305, no thermals): 28.65,37.74 29.26,37.74 29.51,37.57 31.09,37.57 31.09,37.72 33.38,37.72 33.38,38.96 33.07,39.27 32.59,39.27 32.59,40.11 29.8,40.11 28.65,38.96
LINUX_ENABLE_POWER  (via drill 0.2)
  Top 0.203: SW2.4 32.23,41.45 R25.1 v30.91,42.9 | U2.15 15.14,37.46 18.06,40.39 v26.65,40.39
  Bottom 0.203: v26.65,40.39 29.16,42.9 v30.91,42.9
MEMORY_MISO  (via drill 0.2)
  Top 0.203: U1.23 40.42,59.4 40.03,59.79 v39.4,59.79 | U2.24 10.64,38.2 15.21,42.77 17.48,42.77 20.9,46.2 23.32,46.2 23.49,46.37 U4.2 23.49,47.19 v24.64,48.34
  Route2 0.203: v24.64,48.34 24.64,43.46 21.97,40.79 20.4,40.79 17.32,37.72 17.32,22.68 20.32,19.69 20.32,16.64 21.64,15.32 26.77,15.32 27.46,14.63 28.83,14.63 29.62,13.84 29.62,10.06 28.96,9.4 28.96,6.98 J10.7
  Bottom 0.203: v39.4,59.79 37.8,59.79 26.34,48.34 v24.64,48.34
MEMORY_MOSI  (via drill 0.2)
  Top 0.203: U2.23 11.14,38.19 15.29,42.34 19.05,42.34 v19.61,42.9 U4.5 | v38.68,59.03 39.9,59.03 U1.24
  Route2 0.203: J10.5 26.42,6.98 26.42,9.5 27.08,10.16 27.08,13.84 26.49,14.43 21.21,14.43 19.56,16.08 19.56,19.3 13.13,25.73 13.13,29.64 12.65,30.12 11.12,30.12 9.53,31.73 9.53,36.88 15.55,42.9 v19.61,42.9
  Bottom 0.203: v19.61,42.9 20.02,42.9 21.64,41.28 22.53,41.28 24.49,43.23 24.49,45.93 37.58,59.03 v38.68,59.03
MEMORY_SCLK  (via drill 0.2)
  Top 0.203: U1.22 40.92,59.76 v40.31,60.38 | U2.22 11.64,38.18 15.34,41.89 v22.07,41.89 22.1,41.89 22.54,42.32 U4.6
  Route2 0.203: v22.07,41.89 19.15,41.89 16.89,39.62 16.89,22.53 19.91,19.51 19.91,16.43 21.44,14.91 26.65,14.91 27.28,14.27 28.02,14.27 28.32,13.97 28.32,10.24 27.69,9.6 J10.6
  Bottom 0.203: v22.07,41.89 22.07,47.8 24.74,50.47 27.94,50.47 37.85,60.38 v40.31,60.38
MOD0_IN  (via drill 0.2)
  Top 0.203: U1.11 46.55,57.8 46.91,58.17 46.91,68.12 49.15,70.36 v49.15,78.33
  Bottom 0.203: J1.9 37.08,77.98 37.44,78.33 v49.15,78.33
MOD0_OUT  (via drill 0.2)
  Top 0.203: U1.32 38.59,54.8 38.48,54.69 37.97,54.69 37.64,55.02 37.64,59 v39.85,61.21
  Bottom 0.203: v39.85,61.21 39.85,69.11 J1.10
MOD1_IN  (via drill 0.2)
  Top 0.203: U1.12 46.17,67.94 48.78,70.54 48.78,77.45 47.43,78.8 33,78.8 v32.77,79.03
  Bottom 0.203: J1.11 v32.77,79.03
MOD1_OUT  (via drill 0.2)
  Top 0.203: U1.33 37.8,54.3 37.28,54.82 37.28,59.2 39.09,61.01 v39.09,62.08
  Bottom 0.203: v39.09,62.08 39.09,68.94 39.09,69.27 39.09,69.34 35.92,72.52 33.98,72.52 J1.12
MOD2_IN  (via drill 0.2)
  Top 0.203: U1.15 44.42,59.69 45.8,61.06 45.8,68.07 48.34,70.62 48.34,77.29 47.22,78.42 32.44,78.42 30.43,78.42 v30.23,78.62
  Bottom 0.203: J1.13 v30.23,78.62
MOD2_OUT  (via drill 0.2)
  Top 0.203: U1.34 37.77,53.8 36.91,54.65 36.91,59.37 38.38,60.83 v38.38,63.09
  Bottom 0.203: v38.38,63.09 38.38,69.49 35.74,72.14 33.63,72.14 33.25,72.52 31.37,72.52 J1.14
MOD5_IN  (via drill 0.2)
  Top 0.203: U1.16 43.92,59.69 45.44,61.21 45.44,68.22 47.91,70.69 47.91,77.11 47.02,78.01 29.49,78.01 27.89,78.01 v27.69,78.21
  Bottom 0.203: J1.15 v27.69,78.21
MOD5_OUT  (via drill 0.2)
  Top 0.203: U1.35 37.71,53.3 36.54,54.47 36.54,59.53 37.64,60.63 v37.64,64.34
  Bottom 0.203: v37.64,64.34 37.64,69.6 35.51,71.73 33.2,71.73 32.79,72.14 29.21,72.14 J1.16
MOD6_IN  (via drill 0.2)
  Top 0.203: U1.20 41.92,60.72 45.09,63.88 45.09,68.4 47.47,70.79 47.47,76.93 46.8,77.6 25.37,77.6 v25.15,77.82
  Bottom 0.203: J1.17 v25.15,77.82
MOD6_OUT  (via drill 0.2)
  Top 0.203: U1.36 37.62,52.8 36.16,54.26 36.16,59.71 36.93,60.48 v36.93,65.33
  Bottom 0.203: v36.93,65.33 36.93,69.72 35.31,71.35 32.87,71.35 32.46,71.75 27.05,71.75 J1.18
MOD7_IN
  Top 0.203: U1.21 41.42,60.73 44.73,64.03 44.73,68.58 47.04,70.89 47.04,76.72 46.54,77.21 23.62,77.21 J1.19
MOD7_OUT  (via drill 0.2)
  Top 0.203: U1.37 37.74,52.05 35.79,54 35.79,59.87 36.14,60.22 v36.14,66.29
  Bottom 0.203: v36.14,66.29 36.14,69.93 35.13,70.94 32.56,70.94 32.11,71.4 24.87,71.4 J1.20
MODULES_SCL  (via drill 0.2)
  Top 0.203: U1.44 43.42,51.47 43.31,51.36 43.31,48.92 v41.99,47.6 | U2.44 14.14,29.22 14.05,29.13 14.05,28.25 v14.55,27.74 15.29,27 21.51,27 22.33,27.81 22.33,29.06 23.57,30.3 24.38,30.3 24.71,30.63 24.71,36.73 28.96,40.97 28.96,45.59 30.23,46.86 v34.04,46.86 | U7.14 18.07,21.55 14.55,25.07 v14.55,25.76 14.96,26.16 22.99,26.16 25.6,23.55 27.64,23.55 28.37,22.81 28.37,21.97 27.41,21.01 27.41,17.14 28.41,16.15 34.95,16.15 J1.24
  Bottom 0.203: v41.99,47.6 41.25,46.86 v34.04,46.86 | v14.55,27.74 v14.55,25.76
MODULES_SCL_1V8  (via drill 0.2)
  Top 0.203: U7.7 25.9,21.55 v26.01,21.44
  Bottom 0.203: v26.01,21.44 26.01,23.75 26.59,24.33 31.93,24.33 33.29,25.7 33.29,26.4 32.98,26.71 E_1.45
MODULES_SDA  (via drill 0.2)
  Top 0.203: U1.43 42.92,49.55 41.3,47.93 41.3,46.69 v40.87,46.25 | U2.43 13.64,27.69 | v35.31,46.25 30.12,46.25 29.34,45.47 29.34,40.84 25.12,36.63 25.12,30.33 24.74,29.95 23.72,29.95 22.73,28.96 22.73,27.61 21.69,26.57 | 13.64,27.69 14.76,26.57 21.69,26.57 | 13.64,27.69 13.64,25.4 17.99,21.05 U7.15 | 21.69,26.57 23.52,26.57 26.14,23.95 27.74,23.95 28.73,22.96 28.73,21.74 27.79,20.8 27.79,17.27 28.52,16.54 34.62,16.54 35.26,17.17 35.26,19 J1.23
  Bottom 0.203: v40.87,46.25 v35.31,46.25
MODULES_SDA_1V8  (via drill 0.2)
  Top 0.203: U7.6 25.25,21.05 v25.45,20.85
  Bottom 0.203: v25.45,20.85 25.45,23.72 26.44,24.71 31.78,24.71 32.89,25.83 32.89,26.26 32.58,26.58 E_1.47
N$1
  Top 0.305: U3.17 23.57,71.09 23.01,71.65 19.05,71.65 17.15,69.75 FB1.1
N$2
  Bottom 0.203: U6.1 55.26,58.99 55.63,59.36 57.53,59.36 58.22,58.67 58.22,57.02 58.6,56.64 R1.2
N$3
  Top 0.305: FB1.2 17.12,67.31
  Top 0.356: U3.19 21.03,68.15 20.22,67.33 FB1.2 | 17.12,67.31 J3.SIG
N$4
  Bottom 0.203: U6.12 55.26,53.4 55.63,53.04 57.53,53.04 58.22,53.72 58.22,55.37 58.6,55.75 R2.2
N$5
  Bottom 0.203: J4.2 63.3,38.73 59.11,38.73 58.85,38.99 58.85,39.75 57.96,40.64 56.57,40.64 56.11,40.19 U5.6
N$6
  Bottom 0.203: J4.3 59.11,38.1 58.85,37.85 58.85,37.08 57.96,36.2 56.57,36.2 56.11,36.65 U5.2
N$7
  Top 0.203: R8.1 27.25,43.18 D2.3
N$8
  Top 0.203: R9.1 26.39,43.28 D2.4
N$9
  Top 0.203: D2.2 27.28,44.96 R10.1
N$10
  Bottom 0.203: 61.07,59.13 FB2.P$2
  Bottom 0.305: J5.1 62.45,57.18 61.47,58.17 61.47,58.73 61.07,59.13
N$11  (via drill 0.2)
  Top 0.203: v31.47,26.04 31.47,24.59 31.22,24.33 28.8,24.33 27.66,25.48 J13.1
  Bottom 0.203: E_1.53 31.38,26.13 v31.47,26.04
N$12
  Top 0.203: U7.12 18.21,22.55 17.17,23.59 R7.2
N$13  (via drill 0.2)
  Top 0.203: J13.3 31.52,26.82 v32.26,26.09
  Bottom 0.203: E_1.51 31.78,26.57 v32.26,26.09
N$14
  Top 0.203: 33.68,37.14 VR1.6 | 35.83,37.19 36.2,37.19 36.25,37.14
  Top 0.508: 35.83,37.19 L1.P$1
  Top 0.762: 33.68,37.14 36.25,37.14
N$15
  Top 0.508: J15.2 44.86,43.71 D1.CATHODE
N$16  (via drill 0.2)
  Top 0.203: R23.1 v40.12,42.78 R24.2
  Route15 0.203: v40.12,42.78 41.3,42.78 J8.1
N$17  (via drill 0.2)
  Top 0.203: R14.2 R15.2
  Top 0.305: v13.89,53.12 v13.89,53.11 C27.1 | R16.2 7.26,52.6 | C27.1 | R22.2 3.57,52.86 Q2.3 7.14,52.93 7.37,52.71 | 7.26,52.6 R14.2 | C27.1 7.77,53.11 7.37,52.71 | 7.37,52.71 7.26,52.6
  Bottom 0.203: J2.4
  Bottom 0.305: v13.89,53.11 J2.4
N$18
  Top 0.305: SW2.3 33.1,41.45
  Top 0.508: 33.1,41.45 R25.2 33.94,43.74 J14.2
N$24  (via drill 0.2)
  Top 0.203: v57.64,53.98 R3.1
  Bottom 0.203: U6.7 57.52,54.1 v57.64,53.98
N$25  (via drill 0.2)
  Top 0.203: v56.03,53.98 R4.1
  Bottom 0.203: v56.03,53.98 56.16,54.1 U6.10
N$28  (via drill 0.2)
  Top 0.203: 56.67,59.94 C7.1
  Top 0.305: v56.62,58.42 C7.1 | v57.91,59.94 56.67,59.94
  Bottom 0.203: 59.33,59.29 FB2.P$1 58.77,59.94
  Bottom 0.305: U6.4 v56.62,58.42 | v57.91,59.94 58.77,59.94
N$29  (via drill 0.2)
  Top 0.305: U2.19 13.14,38.33 v13.49,38.68
  Bottom 0.305: v13.49,38.68 FB3.1 C8.1
N$30  (via drill 0.2)
  Top 0.203: v43.18,32.26 43.18,34.06 40.46,36.78 40.13,37.11 40.07,37.17 Q1.3
  Bottom 0.203: E_1.3 41.38,28.42 41.66,28.7 42.16,28.7 42.67,29.21 42.67,31.24 43.18,31.75 v43.18,32.26
N$31  (via drill 0.2)
  Top 0.203: U7.8 26.46,22.05 v26.62,21.9
  Bottom 0.203: v26.62,21.9 26.62,23.55 27.03,23.95 32.08,23.95 34.58,26.45 E_1.37
N$32  (via drill 0.2)
  Top 0.305: U1.19 42.42,60.35 v42.95,60.88
  Bottom 0.203: FB4.1
  Bottom 0.305: FB4.1 C13.1 | v42.95,60.88 FB4.1
N$34
  Top 0.203: D3.2 R5.1
N$37
  Top 0.203: R6.1 18.9,25.27 D3.4
N$38
  Top 0.203: R7.1 18.9,24 D3.3
N$43  (via drill 0.2)
  Top 0.203: U7.9 27.21,22.55 v27.38,22.38
  Bottom 0.203: v27.38,22.38 27.38,23.22 27.71,23.55 32.28,23.55 34.98,26.24 E_1.35
N$44
  Top 0.305: 51,57.48 L3.P$1 | U1.7 47.57,55.8 48.23,56.46 C17.1 50.04,57.73 51.25,57.73 L3.P$1 | L3.P$1 51.87,58.35 C26.1
N$45
  Top 0.305: U2.7 17.85,33.6 18.52,34.27 C12.1 20.75,35.54 21.49,35.54 | 21.49,35.54 L2.P$1 | C25.1 20.8,36.22 21.49,35.54
N$46
  Top 0.305: U2.5 21.48,32.6 L2.P$2
N$48
  Top 0.203: U2.25 9.19,36.1 8.94,35.85 9.19,35.6 U2.26
N$50
  Top 0.203: 18.18,22.05 U7.13 18.13,22.05 16.51,23.66 16.51,24.61 R6.2
N$51
  Top 0.203: U2.29 9.19,34.1 8.94,34.35 9.19,34.6 U2.28
N$52
  Top 0.305: U1.5 50.72,54.8 L3.P$2
N$53
  Top 0.203: 38.73,56.3 U1.29 38.48,56.3 38.23,56.55 38.48,56.8 U1.28
N$54
  Top 0.203: U1.26 38.48,57.8 38.23,58.05 38.48,58.3 U1.25 38.73,58.3
PPS  (via drill 0.2)
  Top 0.203: U3.3 22.3,54.5 28.58,48.23 28.58,41.1 24.33,36.85 24.33,31.36 v24.11,31.14 | v23.16,24.66 24.69,23.14 27.46,23.14 27.99,22.61 27.99,22.12 26.77,20.9 v26.77,18.95
  Bottom 0.203: v23.16,24.66 22.73,25.1 22.73,28.96 24.11,30.33 v24.11,31.14 | v26.77,18.95 26.77,17.2 28.22,15.75 33.83,15.75 35.26,17.17 35.26,19.1 J1.25
SD_DETECT  (via drill 0.2)
  Top 0.203: U2.36 8.35,30.6 5.74,33.22 v5.33,33.62 | R22.1 4.72,48.3 v4.72,46.74
  Bottom 0.203: v4.72,46.74 6.19,46.74 J2.A 6.27,46.03 7.04,45.26 9.78,45.26 10.46,44.58 10.46,39.62 5.36,34.52 5.33,34.52 v5.33,33.62
SD_ENABLE  (via drill 0.2)
  Top 0.203: Q2.1 5.31,51.54 R13.2 5.69,50.32 7.62,48.39 v7.62,46.23 | v12.19,28.09 12.7,28.6 12.7,29.24 12.64,29.3 U2.41
  Bottom 0.203: v12.19,28.09 10.85,28.09 5.99,32.94 5.99,34.59 10.9,39.5 10.9,44.7 9.98,45.62 8.23,45.62 v7.62,46.23
SD_MISO  (via drill 0.2)
  Top 0.203: R16.1 v13.89,49.81 13.89,43.03 7.57,36.71 7.57,32.54 8.51,31.6 U2.34
  Route2 0.203: v13.89,49.81 13.89,43.05 7.57,36.73 7.57,31.98 11.02,28.52 11.02,25.98 18.36,18.64 18.36,14.66 19.43,13.59 19.43,11.43 J10.2
  Bottom 0.203: J2.7 v13.89,49.81
SD_MOSI  (via drill 0.2)
  Top 0.203: v13.89,54.21 R14.1 | U2.35 8.44,31.1 7.2,32.34 7.2,36.86 12.7,42.36 v12.7,48.62
  Route2 0.203: v12.7,48.62 12.7,42.37 7.21,36.88 7.21,31.73 10.64,28.3 10.64,25.65 16.97,19.33 16.97,15.14 18.01,14.1 18.01,10.31 J10.1
  Bottom 0.203: J2.3 v13.89,54.21 12.7,53.02 v12.7,48.62
SD_SCLK  (via drill 0.2)
  Top 0.203: U2.33 8.59,32.1 7.94,32.75 7.94,36.52 14.58,43.16 14.58,51.33 v13.89,52.02
  Route2 0.203: J10.3 23.85,7.01 23.85,9.45 20.93,12.37 20.7,12.6 20.7,13.49 18.77,15.42 18.77,18.9 11.56,26.11 11.56,28.55 7.95,32.16 7.95,36.53 14.58,43.16 14.58,51.33 v13.89,52.02
  Bottom 0.203: J2.5 v13.89,52.02
SMBCLK  (via drill 0.2)
  Top 0.203: U1.42 42.42,49.56 41.68,48.82 v38.23,48.82 | J1.5 39.17,74.98 39.17,69.06 38.68,68.58 35.32,68.58 34.03,67.28 34.03,52.05 v36.55,49.53
  Bottom 0.203: v38.23,48.82 37.26,48.82 v36.55,49.53
SMBDATA  (via drill 0.2)
  Top 0.203: U1.41 41.92,51.42 42.01,51.33 42.01,50.34 41.66,49.99 v38.23,49.99 | J1.3 41.63,74.91 41.63,70.13 39.17,67.67 35.54,67.67 34.77,66.89 34.77,53.14 v36.55,51.36
  Bottom 0.203: v38.23,49.99 37.92,49.99 v36.55,51.36
STORAGE_BUCK/LDO_N
  Top 0.203: U2.3 21.41,31.6 R11.1
STORAGE_SWDCLK  (via drill 0.2)
  Top 0.203: J6.4 6.66,41.81 11,41.81 11.66,42.47 v11.68,42.47 | U2.9 17.43,34.6 18.06,35.23 18.06,35.76 R19.1 18.52,36.65 v18.97,37.11
  Bottom 0.203: v18.97,37.11 18.97,38.43 14.94,42.47 v11.68,42.47
STORAGE_SWDIO  (via drill 0.2)
  Top 0.203: J6.2 5.99,42.42 5.99,44.55 6.68,45.23 9.81,45.23 11.18,43.87 v11.68,43.87 | U2.10 17.35,35.1 17.65,35.41 17.65,37.14 R18.1 v18.52,39.73
  Bottom 0.203: v11.68,43.87 14.4,43.87 14.4,43.84 v18.52,39.73
STORAGE_XIN
  Top 0.203: U2.1 17.3,30.19 C1.1 17.31,28.54 X1.3
STORAGE_XOUT
  Top 0.203: C2.1 21.68,30.09 X1.1 19.37,31.1 U2.2
USB_ATTACHED_3V3  (via drill 0.2)
  Top 0.203: v57.58,37.34 57.58,35.81 56.62,34.85 v54.1,34.85 | Q1.1 48.64,40.34 | J8.2 49.38,45.06 49.38,41.08 48.64,40.34 | v49.3,37.85 49.3,39.68 48.64,40.34
  Bottom 0.203: v57.58,37.34 57.58,37.59 57.21,37.96 U5.10 | v54.1,34.85 53.16,35.79 51.23,35.79 49.3,37.72 v49.3,37.85
USB_D+
  Bottom 0.203: U5.3 55.04,38.02 54.86,37.85 54.03,37.85 53.72,38.15 53.72,38.48 53.47,38.73 46.86,38.73 38.98,30.85 E_1.16
USB_D-
  Bottom 0.203: E_1.18 38.61,30.05 38.61,30.99 46.74,39.12 54.74,39.12 55.04,38.82 U5.5
USB_MOD_D+  (via drill 0.2)
  Top 0.203: v56.82,36.83 56.06,36.07 54.15,36.07 53.47,36.75 52.48,36.75 52.15,36.42 52.15,34.9 50.01,32.77 45.47,32.77 43.69,30.99 43.69,26.75 38.91,21.97 31.17,21.97 30.42,21.22 30.42,19.6 30.93,19.08 32.06,19.08 32.72,19.74 32.72,20.55 32.44,20.83 32,20.83 J1.27
  Bottom 0.203: U5.1 56.51,37.39 56.82,37.08 v56.82,36.83
USB_MOD_D-  (via drill 0.2)
  Top 0.203: v56.82,40.01 56.21,40.62 53.99,40.62 52.98,39.61 52.98,37.82 51.79,36.63 51.79,35.08 49.84,33.12 45.29,33.12 43.31,31.14 43.31,26.9 38.73,22.33 30.98,22.33 30.06,21.4 30.06,19.22 J1.28
  Bottom 0.203: U5.7 56.51,39.7 v56.82,40.01
USB_VBUS  (via drill 0.2)
  Top 0.203: v42.92,40.97 v42.93,40.97 | 42.93,41.2 v42.93,40.97 | R23.2 41.99,41.91 v42.93,40.97
  Top 0.508: v48.56,41.76 D1.ANODE 43.71,41.76 v42.93,40.97
  Bottom 0.203: E_1.20 38.18,33.38 42.93,38.12 v42.93,40.97
  Bottom 0.508: J4.1 60.35,39.4 59.92,39.83 59.92,41.33 59.49,41.76 v48.56,41.76
VCC_CONTROLLER  (via drill 0.2)
  Top 0.203: J7.1 52.73,65.13 50.55,65.13 | R12.2 v52.7,52.66 v52.7,52.65 | J6.1 4.19,42.39 4.19,44.2 v4.75,44.76 | 19.33,38.05 R18.2 | R11.2 v22.58,30.48
  Top 0.305: U1.40 v41.42,51.11 | U1.45 v43.92,51.11 | U1.27 38.33,57.3 v38.2,57.3 | U1.31 38.41,55.3 v38.2,55.3 | U1.8 46.95,56.3 v48.46,57.81 49.2,58.55 R21.2 49.91,60.07 49.91,61.19 R20.2 49.2,64.21 50.11,65.13 50.55,65.13 | U2.45 v14.64,28.91 | U2.40 v12.14,28.91 | U2.31 v8.92,33.1 | U2.27 v8.92,35.1 | U2.8 17.57,34.1 v18.77,35.31 19.38,35.92 R19.2 19.84,36.68 19.84,37.54 R18.2 | U4.3 22.54,48.36 C19.1 v22.51,49.25 v22.5,49.25 | U4.7 23.49,42.26 23.96,41.78 24.44,42.26 U4.8 25.35,43.81 v25.35,44.93 D2.1 | Q2.2 5.77,53.9 v5.77,55.07
  Top 0.508: U3.12 31.19,67.94 v31.83,67.31 32.46,67.94 U3.11 | U3.11 32.46,68.58 | U3.11 C18.1
  Route15 0.305: J10.20 47.4,6.33 47.4,4.77 45.99,3.37 20.96,3.37 19.84,4.49 19.84,10.06 21.97,12.19 21.97,14.33 20.57,15.72 17.53,15.72
  Bottom 0.203: v52.7,52.65 51.56,53.8 45.87,53.8
  Bottom 0.305: v48.46,57.81 47.29,56.64 C16.1 | v18.77,35.31 18.01,34.54 C11.1
  Bottom 0.508: J1.2 C29.1 45.47,59.84 44.88,59.26
  pour Bottom: 37.77,50.65 47.57,50.65 47.57,60.45 37.77,60.45
  pour Bottom: 18.29,38.25 8.48,38.25 8.48,28.45 18.29,28.45
  pour Route15: -2.79,82.55 58.93,82.55 58.93,62.23 54.1,62.23 54.1,51.93 47.76,45.59 34.56,45.59 25.91,36.95 25.91,29.85 19.94,23.88 19.94,14.61 -2.74,14.61
VCC_LINUX  (via drill 0.2)
  Top 0.508: J1.4 42.93,70.26 39.73,67.06 35.69,67.06 35.28,66.65 35.28,53.69 37.31,51.66 v37.31,43.71 | v37.31,43.71 v41.27,43.71 J15.1 | v37.31,43.71 35.81,43.71 J14.1
  Route15 0.305: J10.17 41.66,6.98 41.66,10.31 43.59,12.24 43.59,16.26
  other vias: 39.42,43.71
  pour Route15: 20.45,14.61 20.45,23.39 26.54,29.49 26.54,36.82 34.63,44.91 48.12,44.91 54.74,51.52 54.74,61.72 70.87,61.72 70.87,14.61
VCC_LINUX_1V8  (via drill 0.2)
  Top 0.203: v56.82,53.98 56.82,54.3 57.12,54.61 58.65,54.61 C23.1 v59.05,48.21 | v40.13,31.12 39.09,32.16 39.09,33.2 v40.13,34.24
  Top 0.305: U7.2 21.81,17.66 | 21.81,17.66 C24.2 21.91,17.48 | 21.81,17.66 22.7,17.66 v22.84,17.53 | U7.10 21.32,23.29 v21.72,23.29
  Route15 0.305: J10.14 37.85,10.19 38.51,10.85 38.51,14.3 36.32,16.49 28.4,16.49 27.64,17.25 27.64,21.26
  Route15 0.508: v22.84,17.53 21.72,18.64 v21.72,23.29 22.23,22.78 25.96,22.78 26.47,23.29 29.67,23.29 | v40.13,31.12 40.13,25.88 37.54,23.29 29.67,23.29 | 27.64,21.26 29.67,23.29
  Bottom 0.203: U6.9 56.62,54.18 v56.82,53.98 | E_1.12 39.78,30.76 v40.13,31.12 | v40.13,34.24 48.34,42.44 56.84,42.44 59.05,44.65 v59.05,48.21
VCC_LINUX_3V3  (via drill 0.2)
  Top 0.203: v58.09,38.42 58.34,38.16 58.34,36.98 58.75,36.58 C22.1 57.96,35.38 v56.57,33.98 56.44,33.86 | VR1.3 28.05,36.89 27.8,36.64 28.05,36.39 VR1.4 v28.97,35.74 | J8.3 51.41,45.57 51.41,38 v48.39,34.98
  Top 0.305: C21.2 U7.19 18.32,19.05 v17.73,18.47 | D3.1 v20.96,25.07 | R17.2 33.71,28.65 35.08,30.02
  Route15 0.305: J10.18 44.17,7.01 44.17,4.39 43.79,4.01 21.46,4.01 20.55,4.93 20.55,9.6 23.24,12.29 23.24,14 20.5,16.74 19.46,16.74 v17.73,18.47
  Route15 0.508: v17.73,18.47 17.73,21.84 v20.96,25.07 21.44,25.55 27.25,25.55 33.76,32.05 v33.76,33.98
  Bottom 0.203: U5.9 v58.09,38.42 | 40.98,29.14 E_1.6 40.98,30.82 41.15,30.99 | 41.38,30.94 E_1.4 41.38,29.21 41.3,29.14 40.98,29.14 | 41.64,30.99 41.78,30.85 E_1.2 41.78,29.34 41.57,29.13 41.02,29.13 | v28.97,35.74 30.96,35.74 31.6,35.1 32.64,35.1 v33.76,33.98 | C20.1 42.16,32.56 44.58,34.98 v48.39,34.98 49.51,34.98 51.38,33.1 55.68,33.1 v56.57,33.98 | E_1.14 39.38,29.03 39.4,29.01 | 40.98,29.14 40.84,29.01
  Bottom 0.406: C20.1 42.16,31.51 41.64,30.99 41.15,30.99
  Bottom 0.508: v35.08,28.73 39.12,28.73 39.4,29.01 40.84,29.01 40.89,29.01
  other vias: 35.99,28.73 36.91,28.73
  pour Top (no thermals): 31.72,34.7 34.14,34.7 34.52,35.08 37.29,35.08 37.29,28.45 34.84,28.45 31.72,31.77

## Text on the board
tPlace: MOD7IN | MOD6IN | MOD5IN | MOD2IN | MOD1IN | MOD0IN | SMBCLK | SMBDAT | GND | MOD7OUT | MOD6OUT | MOD5OUT | MOD2OUT | MOD1OUT | MOD0OUT | SMBALERTn | VCC_LINUX | VCC_CONT | Controller | Signpost Controller / Branden Ghena / 9/15/2016 | A | Edison / Serial | Auto | STORAGE_CSn | Edison / USB Mode | Edison / Program | Storage / Master | CS0 | CS1 | Edison / CS Pin | USBD+ | PPS | MODSDA | GND | Backplane / Reset | USBD- | USB_D+ | MODSCL | BPRSTn | SD_MISO | SD_CSn | MEM_SCLK | SM_CSn | ED_SCLK | ED_MISO | LNX_1V8 | GPS_OUT | LNX_3V3 | VCC_CONT | SD_MOSI | SD_SCLK | MEM_MOSI | MEM_MISO | FRAM_CSn | ED_MOSI | ED_CSn | GPS_IN | VCC_LINUX | GND | GND | GND